# EAGLE design matrix (EAGLE 5.11)
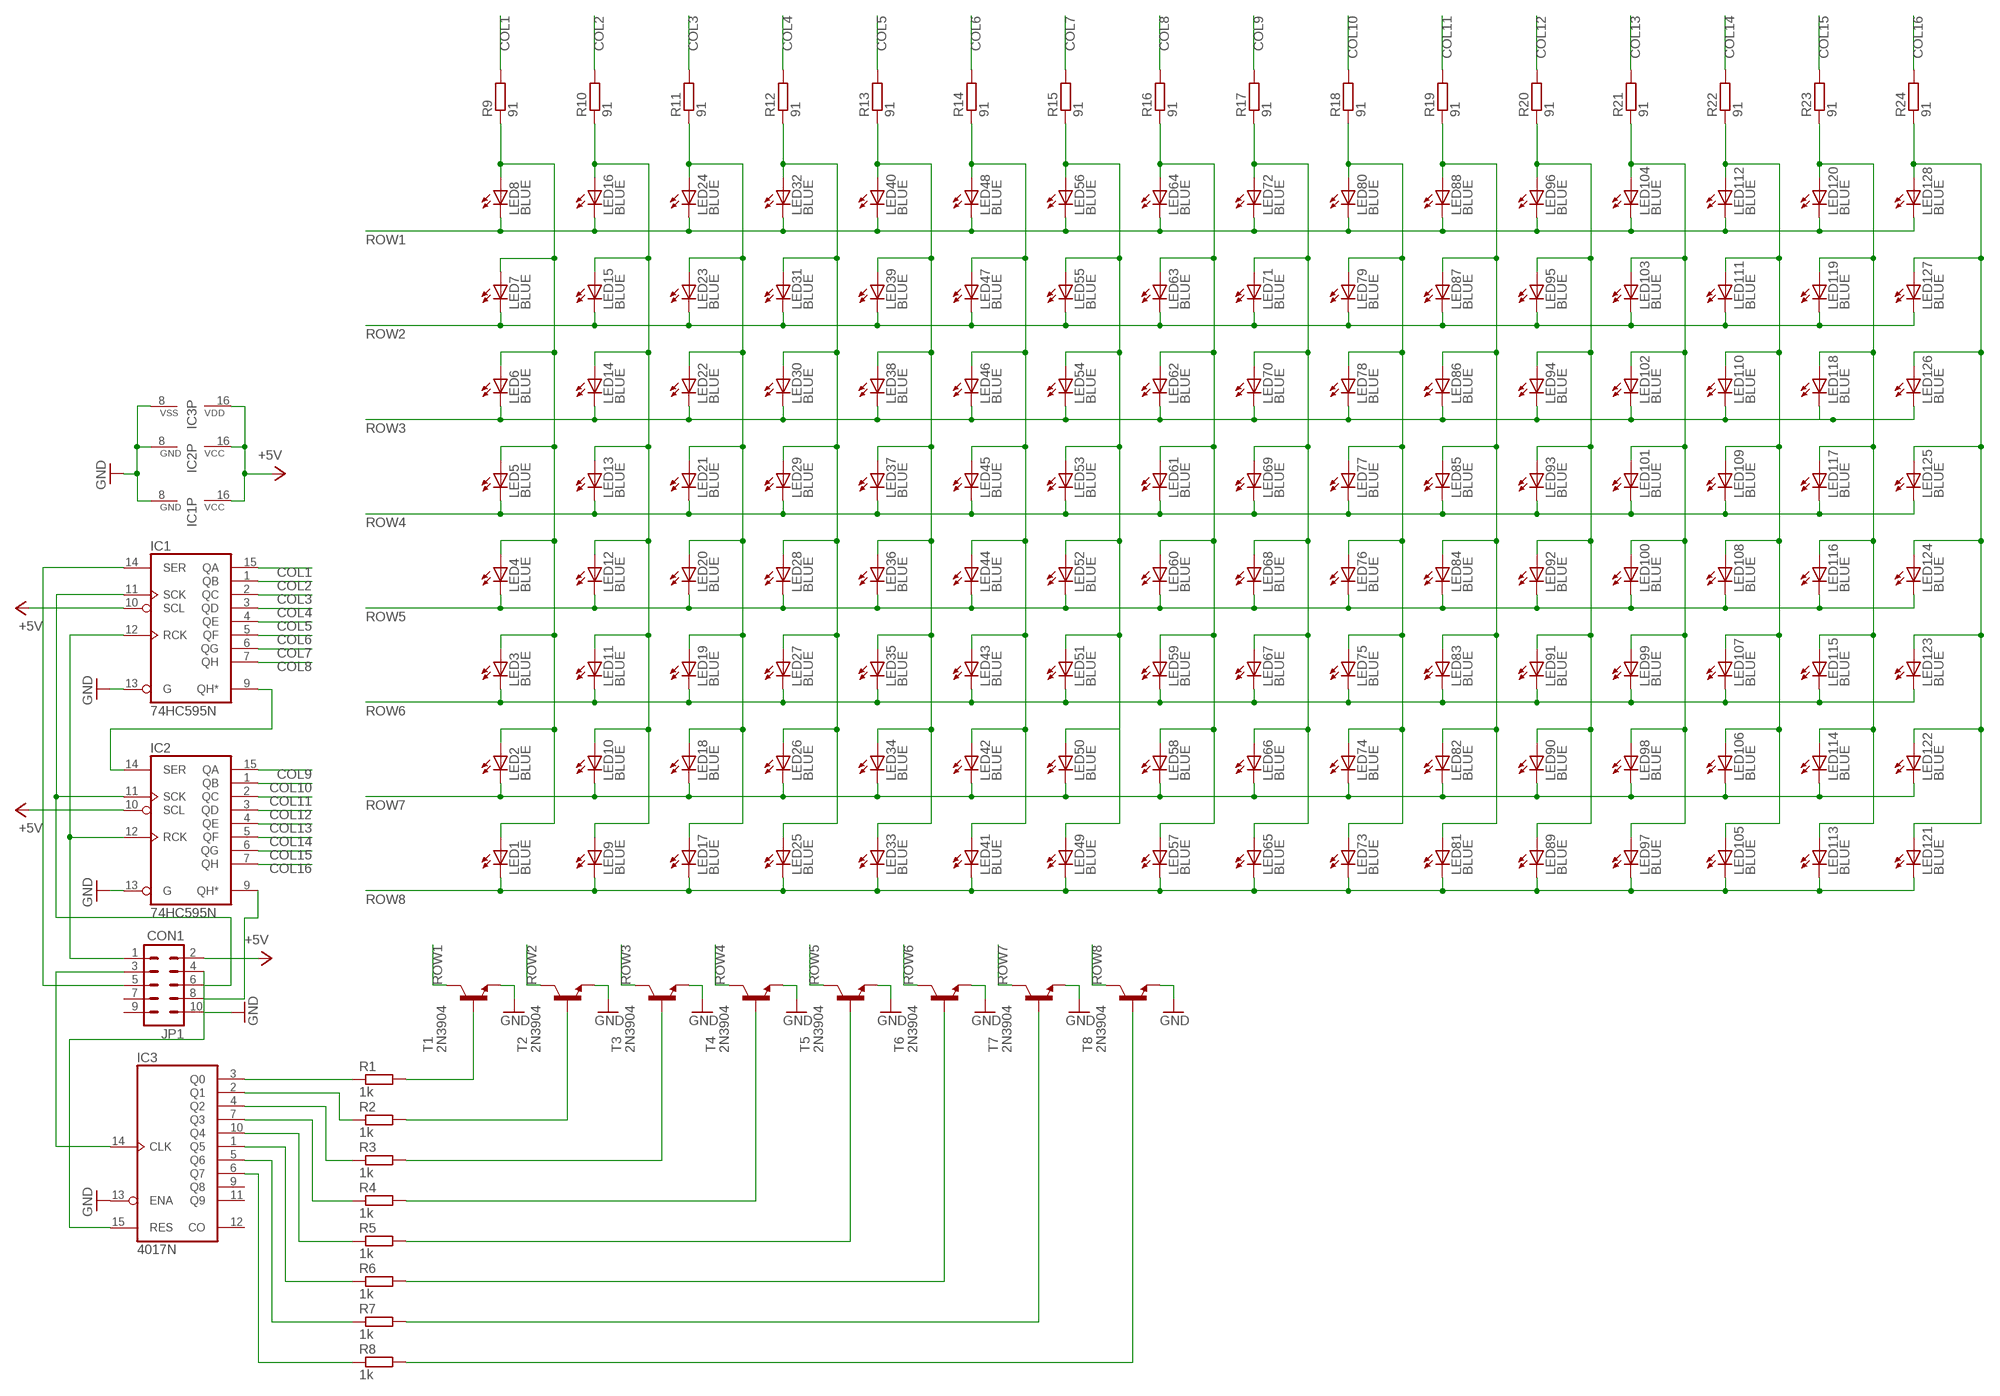
[diagram p0: schematic, sheet 1]

## Parts
IC1  74HC595N  [DIL16]
IC2  74HC595N  [DIL16]
IC3  4017N  [DIL16]
JP1  CON1  ML10  [ML10]
LED1  BLUE  LED5MM  [LED5MM]
LED2  BLUE  LED5MM  [LED5MM]
LED3  BLUE  LED5MM  [LED5MM]
LED4  BLUE  LED5MM  [LED5MM]
LED5  BLUE  LED5MM  [LED5MM]
LED6  BLUE  LED5MM  [LED5MM]
LED7  BLUE  LED5MM  [LED5MM]
LED8  BLUE  LED5MM  [LED5MM]
LED9  BLUE  LED5MM  [LED5MM]
LED10  BLUE  LED5MM  [LED5MM]
LED11  BLUE  LED5MM  [LED5MM]
LED12  BLUE  LED5MM  [LED5MM]
LED13  BLUE  LED5MM  [LED5MM]
LED14  BLUE  LED5MM  [LED5MM]
LED15  BLUE  LED5MM  [LED5MM]
LED16  BLUE  LED5MM  [LED5MM]
LED17  BLUE  LED5MM  [LED5MM]
LED18  BLUE  LED5MM  [LED5MM]
LED19  BLUE  LED5MM  [LED5MM]
LED20  BLUE  LED5MM  [LED5MM]
LED21  BLUE  LED5MM  [LED5MM]
LED22  BLUE  LED5MM  [LED5MM]
LED23  BLUE  LED5MM  [LED5MM]
LED24  BLUE  LED5MM  [LED5MM]
LED25  BLUE  LED5MM  [LED5MM]
LED26  BLUE  LED5MM  [LED5MM]
LED27  BLUE  LED5MM  [LED5MM]
LED28  BLUE  LED5MM  [LED5MM]
LED29  BLUE  LED5MM  [LED5MM]
LED30  BLUE  LED5MM  [LED5MM]
LED31  BLUE  LED5MM  [LED5MM]
LED32  BLUE  LED5MM  [LED5MM]
LED33  BLUE  LED5MM  [LED5MM]
LED34  BLUE  LED5MM  [LED5MM]
LED35  BLUE  LED5MM  [LED5MM]
LED36  BLUE  LED5MM  [LED5MM]
LED37  BLUE  LED5MM  [LED5MM]
LED38  BLUE  LED5MM  [LED5MM]
LED39  BLUE  LED5MM  [LED5MM]
LED40  BLUE  LED5MM  [LED5MM]
LED41  BLUE  LED5MM  [LED5MM]
LED42  BLUE  LED5MM  [LED5MM]
LED43  BLUE  LED5MM  [LED5MM]
LED44  BLUE  LED5MM  [LED5MM]
LED45  BLUE  LED5MM  [LED5MM]
LED46  BLUE  LED5MM  [LED5MM]
LED47  BLUE  LED5MM  [LED5MM]
LED48  BLUE  LED5MM  [LED5MM]
LED49  BLUE  LED5MM  [LED5MM]
LED50  BLUE  LED5MM  [LED5MM]
LED51  BLUE  LED5MM  [LED5MM]
LED52  BLUE  LED5MM  [LED5MM]
LED53  BLUE  LED5MM  [LED5MM]
LED54  BLUE  LED5MM  [LED5MM]
LED55  BLUE  LED5MM  [LED5MM]
LED56  BLUE  LED5MM  [LED5MM]
LED57  BLUE  LED5MM  [LED5MM]
LED58  BLUE  LED5MM  [LED5MM]
LED59  BLUE  LED5MM  [LED5MM]
LED60  BLUE  LED5MM  [LED5MM]
LED61  BLUE  LED5MM  [LED5MM]
LED62  BLUE  LED5MM  [LED5MM]
LED63  BLUE  LED5MM  [LED5MM]
LED64  BLUE  LED5MM  [LED5MM]
LED65  BLUE  LED5MM  [LED5MM]
LED66  BLUE  LED5MM  [LED5MM]
LED67  BLUE  LED5MM  [LED5MM]
LED68  BLUE  LED5MM  [LED5MM]
LED69  BLUE  LED5MM  [LED5MM]
LED70  BLUE  LED5MM  [LED5MM]
LED71  BLUE  LED5MM  [LED5MM]
LED72  BLUE  LED5MM  [LED5MM]
LED73  BLUE  LED5MM  [LED5MM]
LED74  BLUE  LED5MM  [LED5MM]
LED75  BLUE  LED5MM  [LED5MM]
LED76  BLUE  LED5MM  [LED5MM]
LED77  BLUE  LED5MM  [LED5MM]
LED78  BLUE  LED5MM  [LED5MM]
LED79  BLUE  LED5MM  [LED5MM]
LED80  BLUE  LED5MM  [LED5MM]
LED81  BLUE  LED5MM  [LED5MM]
LED82  BLUE  LED5MM  [LED5MM]
LED83  BLUE  LED5MM  [LED5MM]
LED84  BLUE  LED5MM  [LED5MM]
LED85  BLUE  LED5MM  [LED5MM]
LED86  BLUE  LED5MM  [LED5MM]
LED87  BLUE  LED5MM  [LED5MM]
LED88  BLUE  LED5MM  [LED5MM]
LED89  BLUE  LED5MM  [LED5MM]
LED90  BLUE  LED5MM  [LED5MM]
LED91  BLUE  LED5MM  [LED5MM]
LED92  BLUE  LED5MM  [LED5MM]
LED93  BLUE  LED5MM  [LED5MM]
LED94  BLUE  LED5MM  [LED5MM]
LED95  BLUE  LED5MM  [LED5MM]
LED96  BLUE  LED5MM  [LED5MM]
LED97  BLUE  LED5MM  [LED5MM]
LED98  BLUE  LED5MM  [LED5MM]
LED99  BLUE  LED5MM  [LED5MM]
LED100  BLUE  LED5MM  [LED5MM]
LED101  BLUE  LED5MM  [LED5MM]
LED102  BLUE  LED5MM  [LED5MM]
LED103  BLUE  LED5MM  [LED5MM]
LED104  BLUE  LED5MM  [LED5MM]
LED105  BLUE  LED5MM  [LED5MM]
LED106  BLUE  LED5MM  [LED5MM]
LED107  BLUE  LED5MM  [LED5MM]
LED108  BLUE  LED5MM  [LED5MM]
LED109  BLUE  LED5MM  [LED5MM]
LED110  BLUE  LED5MM  [LED5MM]
LED111  BLUE  LED5MM  [LED5MM]
LED112  BLUE  LED5MM  [LED5MM]
LED113  BLUE  LED5MM  [LED5MM]
LED114  BLUE  LED5MM  [LED5MM]
LED115  BLUE  LED5MM  [LED5MM]
LED116  BLUE  LED5MM  [LED5MM]
LED117  BLUE  LED5MM  [LED5MM]
LED118  BLUE  LED5MM  [LED5MM]
LED119  BLUE  LED5MM  [LED5MM]
LED120  BLUE  LED5MM  [LED5MM]
LED121  BLUE  LED5MM  [LED5MM]
LED122  BLUE  LED5MM  [LED5MM]
LED123  BLUE  LED5MM  [LED5MM]
LED124  BLUE  LED5MM  [LED5MM]
LED125  BLUE  LED5MM  [LED5MM]
LED126  BLUE  LED5MM  [LED5MM]
LED127  BLUE  LED5MM  [LED5MM]
LED128  BLUE  LED5MM  [LED5MM]
R1  1k  R-EU_0204/7  [0204/7]
R2  1k  R-EU_0204/7  [0204/7]
R3  1k  R-EU_0204/7  [0204/7]
R4  1k  R-EU_0204/7  [0204/7]
R5  1k  R-EU_0204/7  [0204/7]
R6  1k  R-EU_0204/7  [0204/7]
R7  1k  R-EU_0204/7  [0204/7]
R8  1k  R-EU_0204/7  [0204/7]
R9  91  R-EU_0204/7  [0204/7]
R10  91  R-EU_0204/7  [0204/7]
R11  91  R-EU_0204/7  [0204/7]
R12  91  R-EU_0204/7  [0204/7]
R13  91  R-EU_0204/7  [0204/7]
R14  91  R-EU_0204/7  [0204/7]
R15  91  R-EU_0204/7  [0204/7]
R16  91  R-EU_0204/7  [0204/7]
R17  91  R-EU_0204/7  [0204/7]
R18  91  R-EU_0204/7  [0204/7]
R19  91  R-EU_0204/7  [0204/7]
R20  91  R-EU_0204/7  [0204/7]
R21  91  R-EU_0204/7  [0204/7]
R22  91  R-EU_0204/7  [0204/7]
R23  91  R-EU_0204/7  [0204/7]
R24  91  R-EU_0204/7  [0204/7]
T1  2N3904  [TO92]
T2  2N3904  [TO92]
T3  2N3904  [TO92]
T4  2N3904  [TO92]
T5  2N3904  [TO92]
T6  2N3904  [TO92]
T7  2N3904  [TO92]
T8  2N3904  [TO92]

## Nets
+5V: IC1.10(SCL) IC1.16(VCC) IC2.10(SCL) IC2.16(VCC) IC3.16(VDD) JP1.2
COL1: IC1.15(QA) R9.2
COL2: IC1.1(QB) R10.2
COL3: IC1.2(QC) R11.2
COL4: IC1.3(QD) R12.2
COL5: IC1.4(QE) R13.2
COL6: IC1.5(QF) R14.2
COL7: IC1.6(QG) R15.2
COL8: IC1.7(QH) R16.2
COL9: IC2.15(QA) R17.2
COL10: IC2.1(QB) R18.2
COL11: IC2.2(QC) R19.2
COL12: IC2.3(QD) R20.2
COL13: IC2.4(QE) R21.2
COL14: IC2.5(QF) R22.2
COL15: IC2.6(QG) R23.2
COL16: IC2.7(QH) R24.2
GND: IC1.8(GND) IC1.13(G) IC2.8(GND) IC2.13(G) IC3.8(VSS) IC3.13(ENA) JP1.10 T1.3(E) T2.3(E) T3.3(E) T4.3(E) T5.3(E) T6.3(E) T7.3(E) T8.3(E)
N$1: IC1.9(QH*) IC2.14(SER)
N$2: IC2.9(QH*) JP1.8
N$3: IC1.12(RCK) IC2.12(RCK) JP1.1
N$4: LED121.A LED122.A LED123.A LED124.A LED125.A LED126.A LED127.A LED128.A R24.1
N$5: IC1.11(SCK) IC2.11(SCK) JP1.6
N$6: IC1.14(SER) JP1.5
N$7: IC3.14(CLK) JP1.3
N$8: IC3.15(RES) JP1.4
N$9: IC3.3(Q0) R1.1
N$10: IC3.2(Q1) R2.1
N$11: IC3.4(Q2) R3.1
N$12: IC3.7(Q3) R4.1
N$13: IC3.10(Q4) R5.1
N$14: IC3.1(Q5) R6.1
N$15: IC3.5(Q6) R7.1
N$16: IC3.6(Q7) R8.1
N$17: R1.2 T1.2(B)
N$18: R2.2 T2.2(B)
N$19: R3.2 T3.2(B)
N$20: R4.2 T4.2(B)
N$21: R5.2 T5.2(B)
N$22: R6.2 T6.2(B)
N$23: R7.2 T7.2(B)
N$24: R8.2 T8.2(B)
N$25: LED1.A LED2.A LED3.A LED4.A LED5.A LED6.A LED7.A LED8.A R9.1
N$26: LED9.A LED10.A LED11.A LED12.A LED13.A LED14.A LED15.A LED16.A R10.1
N$29: LED33.A LED34.A LED35.A LED36.A LED37.A LED38.A LED39.A LED40.A R13.1
N$30: LED41.A LED42.A LED43.A LED44.A LED45.A LED46.A LED47.A LED48.A R14.1
N$31: LED49.A LED50.A LED51.A LED52.A LED53.A LED54.A LED55.A LED56.A R15.1
N$32: LED57.A LED58.A LED59.A LED60.A LED61.A LED62.A LED63.A LED64.A R16.1
N$33: LED65.A LED66.A LED67.A LED68.A LED69.A LED70.A LED71.A LED72.A R17.1
N$34: LED73.A LED74.A LED75.A LED76.A LED77.A LED78.A LED79.A LED80.A R18.1
N$35: LED81.A LED82.A LED83.A LED84.A LED85.A LED86.A LED87.A LED88.A R19.1
N$36: LED89.A LED90.A LED91.A LED92.A LED93.A LED94.A LED95.A LED96.A R20.1
N$37: LED97.A LED98.A LED99.A LED100.A LED101.A LED102.A LED103.A LED104.A R21.1
N$38: LED105.A LED106.A LED107.A LED108.A LED109.A LED110.A LED111.A LED112.A R22.1
N$39: LED113.A LED114.A LED115.A LED116.A LED117.A LED118.A LED119.A LED120.A R23.1
N$49: LED17.A LED18.A LED19.A LED20.A LED21.A LED22.A LED23.A LED24.A R11.1
N$50: LED25.A LED26.A LED27.A LED28.A LED29.A LED30.A LED31.A LED32.A R12.1
ROW1: LED8.K(C) LED16.K(C) LED24.K(C) LED32.K(C) LED40.K(C) LED48.K(C) LED56.K(C) LED64.K(C) LED72.K(C) LED80.K(C) LED88.K(C) LED96.K(C) LED104.K(C) LED112.K(C) LED120.K(C) LED128.K(C) T1.1(C)
ROW2: LED7.K(C) LED15.K(C) LED23.K(C) LED31.K(C) LED39.K(C) LED47.K(C) LED55.K(C) LED63.K(C) LED71.K(C) LED79.K(C) LED87.K(C) LED95.K(C) LED103.K(C) LED111.K(C) LED119.K(C) LED127.K(C) T2.1(C)
ROW3: LED6.K(C) LED14.K(C) LED22.K(C) LED30.K(C) LED38.K(C) LED46.K(C) LED54.K(C) LED62.K(C) LED70.K(C) LED78.K(C) LED86.K(C) LED94.K(C) LED102.K(C) LED110.K(C) LED118.K(C) LED126.K(C) T3.1(C)
ROW4: LED5.K(C) LED13.K(C) LED21.K(C) LED29.K(C) LED37.K(C) LED45.K(C) LED53.K(C) LED61.K(C) LED69.K(C) LED77.K(C) LED85.K(C) LED93.K(C) LED101.K(C) LED109.K(C) LED117.K(C) LED125.K(C) T4.1(C)
ROW5: LED4.K(C) LED12.K(C) LED20.K(C) LED28.K(C) LED36.K(C) LED44.K(C) LED52.K(C) LED60.K(C) LED68.K(C) LED76.K(C) LED84.K(C) LED92.K(C) LED100.K(C) LED108.K(C) LED116.K(C) LED124.K(C) T5.1(C)
ROW6: LED3.K(C) LED11.K(C) LED19.K(C) LED27.K(C) LED35.K(C) LED43.K(C) LED51.K(C) LED59.K(C) LED67.K(C) LED75.K(C) LED83.K(C) LED91.K(C) LED99.K(C) LED107.K(C) LED115.K(C) LED123.K(C) T6.1(C)
ROW7: LED2.K(C) LED10.K(C) LED18.K(C) LED26.K(C) LED34.K(C) LED42.K(C) LED50.K(C) LED58.K(C) LED66.K(C) LED74.K(C) LED82.K(C) LED90.K(C) LED98.K(C) LED106.K(C) LED114.K(C) LED122.K(C) T7.1(C)
ROW8: LED1.K(C) LED9.K(C) LED17.K(C) LED25.K(C) LED33.K(C) LED41.K(C) LED49.K(C) LED57.K(C) LED65.K(C) LED73.K(C) LED81.K(C) LED89.K(C) LED97.K(C) LED105.K(C) LED113.K(C) LED121.K(C) T8.1(C)
Unconnected: IC3.9(Q8) IC3.11(Q9) IC3.12(CO) JP1.7 JP1.9

## Library data of the parts
IC1 IC2 = 74xx-eu:74*595: 8-bit SHIFT REGISTER, output latch
IC3 = 40xx:4017: COUNTER/DIVIDER
JP1 = con-harting-ml:ML10: HARTING; OC_FARNELL: unknown; OC_NEWARK: unknown
LED1-LED128 = led:LED: LED OSRAM: - CHIPLED LG R971, LG N971, LY N971, LG Q971, LY Q971, LO R971, LY R971 LH N974, LH R974 LS Q976, LO Q976, LY Q976 LO Q996 - Hyper CHIPLED LW Q18S LB Q993, LB Q99A, LB R99A - SideLED LS A670, LO A670, LY A670, LG A670, LP A670 LB A673, LV A673, LT A673, LW A673 LH A674 LY A675 LS A676, LA A676, LO A676, LY A676, LW A676 LS A679, LY A679, LG A679 - Hyper Micro SIDELED® LS Y876, LA Y876, LO Y876, LY Y876 LT Y87S - SmartLED LW L88C, LW L88S LB L89C, LB L89S, LG L890 LS L89K, LO L89K, LY L89K LS L896, LA L896, LO L896, LY L896 - TOPLED LS T670, LO T670, LY T670, LG T670, LP T670 LSG T670, LSP T670, LSY T670, LOP T670, LYG T670 LG T671, LOG T671, LSG T671 LB T673, LV T673, LT T673, LW T673 LH T674 LS T676, LA T676, LO T676, LY T676, LB T676, LH T676, LSB T676, LW T676 LB T67C, LV T67C, LT T67C, LS T67K, LO T67K, LY T67K, LW E67C LS E67B, LA E67B, LO E67B, LY E67B, LB E67C, LV E67C, LT E67C LW T67C LS T679, LY T679, LG T679 LS T770, LO T770, LY T770, LG T770, LP T770 LB T773, LV T773, LT T773, LW T773 LH T774 LS E675, LA E675, LY E675, LS T675 LS T776, LA T776, LO T776, LY T776, LB T776 LHGB T686 LT T68C, LB T68C - Hyper Mini TOPLED® LB M676 - Mini TOPLED Santana® LG M470 LS M47K, LO M47K, LY M47K Source: http://www.osram.convergy.de LUXEON: - LUMILED® LXK2-PW12-R00, LXK2-PW12-S00, LXK2-PW14-U00, LXK2-PW14-V00 LXK2-PM12-R00, LXK2-PM12-S00, LXK2-PM14-U00 LXK2-PE12-Q00, LXK2-PE12-R00, LXK2-PE12-S00, LXK2-PE14-T00, LXK2-PE14-U00 LXK2-PB12-K00, LXK2-PB12-L00, LXK2-PB12-M00, LXK2-PB14-N00, LXK2-PB14-P00, LXK2-PB14-Q00 LXK2-PR12-L00, LXK2-PR12-M00, LXK2-PR14-Q00, LXK2-PR14-R00 LXK2-PD12-Q00, LXK2-PD12-R00, LXK2-PD12-S00 LXK2-PH12-R00, LXK2-PH12-S00 LXK2-PL12-P00, LXK2-PL12-Q00, LXK2-PL12-R00 Source: www.luxeon.com KINGBRIGHT: KA-3528ASYC Source: www.kingbright.com
R1-R24 = rcl:R-EU_: RESISTOR, European symbol
T1-T8 = transistor:2N3904: NPN TRANSISTOR

## Board
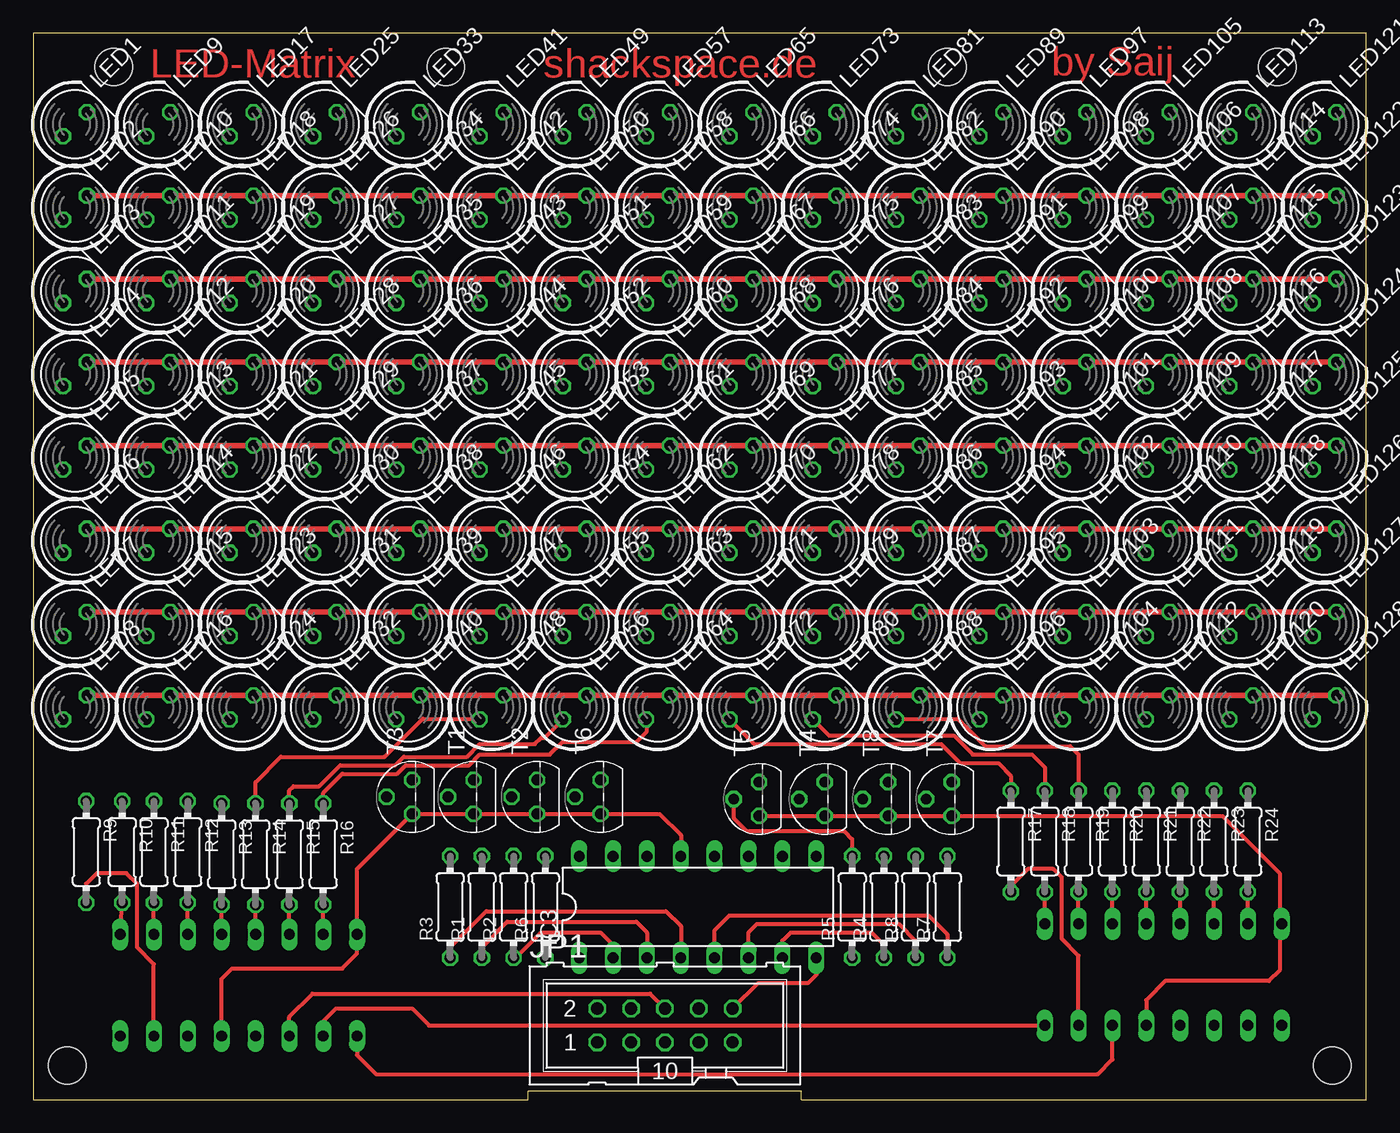
[diagram p1: board, top side]
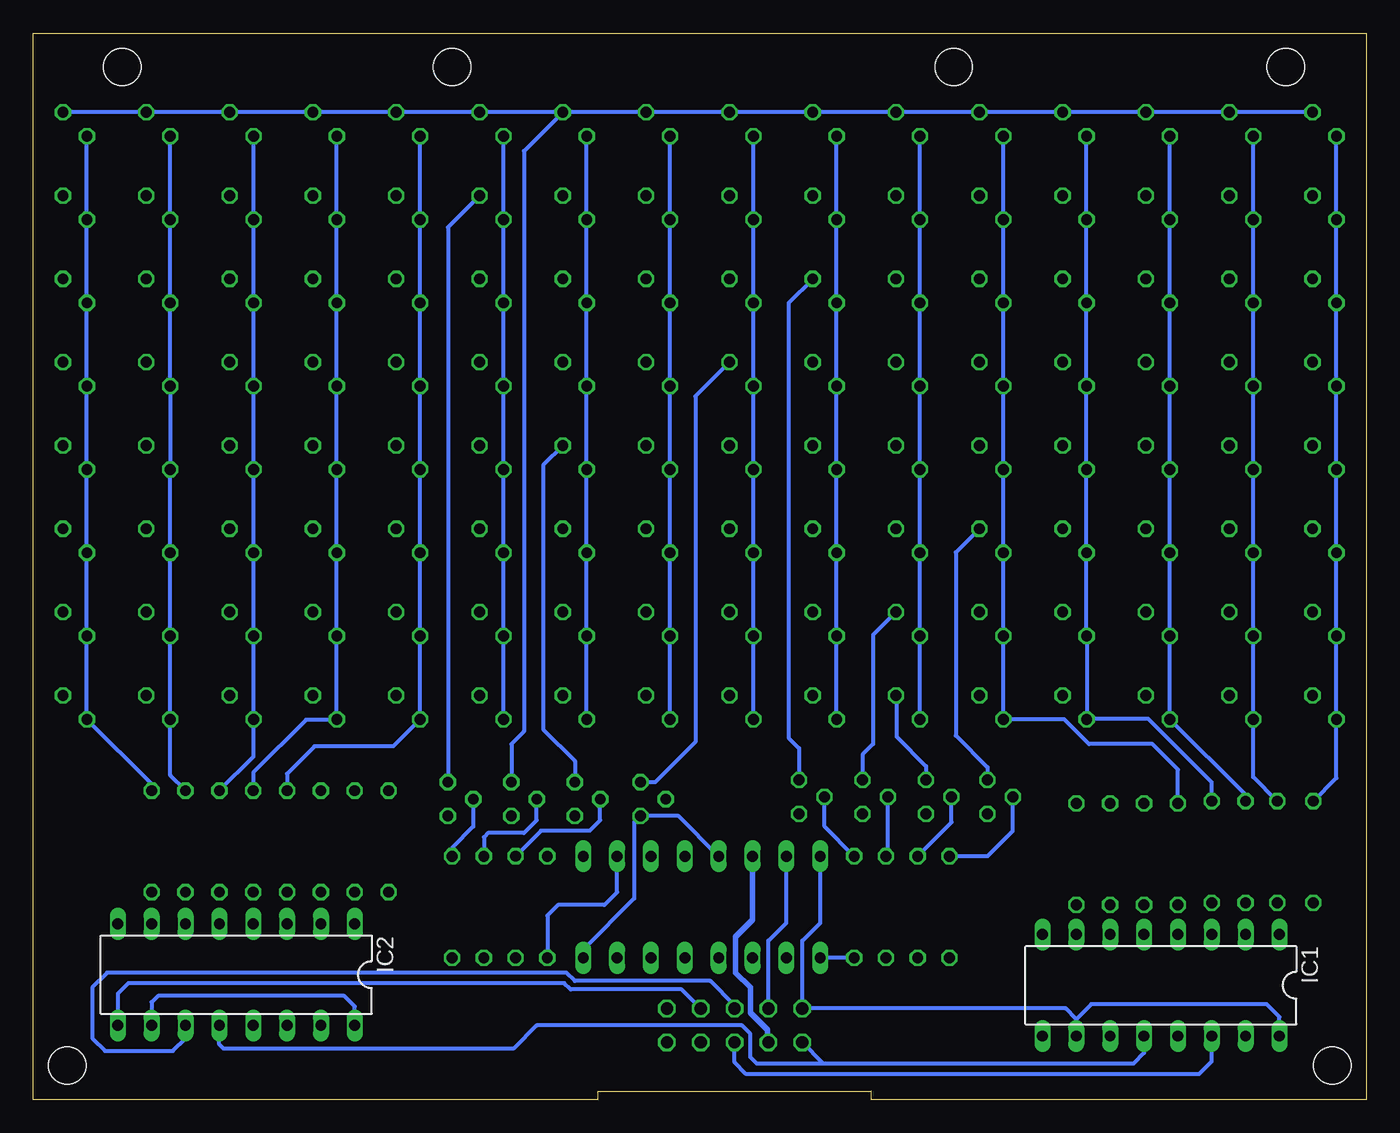
[diagram p2: board, bottom side, seen from below]

Size 100 x 80 mm. Coordinates in mm from the lower left corner, seen from the top.
Outline: 37.13,0.64 37.13,0 0,0 0,80 100,80 100,0 57.63,0 57.63,0.64 37.13,0.64
Outline: 37.13,0.64 37.15,0.64
Copper layers (1*16): Top 0.035mm / dielectric 1.5mm / Bottom 0.035mm
Design rules "PCB-POOL Standard": minimum track width 0.15mm, minimum drill 0.3mm, track to track 0.15mm, track to pad 0.15mm, pad to pad 0.15mm, via to via 0.15mm, smd to smd 0.15mm, copper to edge 0.3mm, drill to drill 0.2mm, minimum pad ring 0.2mm, minimum via ring 0.15mm, stop-mask expansion 0.075mm, vias tented up to drill 0mil, thermal gap 0.2mm
Holes 2.8 mm at 6.03,77.47 93.33,77.47 68.58,77.47 30.96,77.47 2.54,2.54 97.46,2.54

### Footprints (pad centres in the part's own frame; a part is rotated, then mirrored left to right if it is on the bottom)
DIL16 = drill 0.813 long: 1 -8.89,-3.81; 2 -6.35,-3.81; 3 -3.81,-3.81; 4 -1.27,-3.81; 5 1.27,-3.81; 6 3.81,-3.81; 7 6.35,-3.81; 8 8.89,-3.81; 9 8.89,3.81; 10 6.35,3.81; 11 3.81,3.81; 12 1.27,3.81; 13 -1.27,3.81; 14 -3.81,3.81; 15 -6.35,3.81; 16 -8.89,3.81
ML10 = drill 0.914 octagon: 1 -5.08,-1.27; 2 -5.08,1.27; 3 -2.54,-1.27; 4 -2.54,1.27; 5 0,-1.27; 6 0,1.27; 7 2.54,-1.27; 8 2.54,1.27; 9 5.08,-1.27; 10 5.08,1.27
LED5MM = drill 0.813 octagon: A -1.27,0; K 1.27,0
0204/7 = drill 0.813 octagon: 1 -3.81,0; 2 3.81,0
TO92 = drill 0.813 octagon: 1 1.27,0; 2 0,1.905; 3 -1.27,0

### Placement (x,y rotation side)
IC1  15.4,8.57 180 bottom
IC2  84.77,9.37 180 bottom
IC3  49.85,14.45 0 top
JP1  47.39,5.56 0 top
LED1  3.12,73.17 45 top
LED2  3.12,66.92 45 top
LED3  3.12,60.67 45 top
LED4  3.12,54.42 45 top
LED5  3.12,48.17 45 top
LED6  3.12,41.92 45 top
LED7  3.12,35.67 45 top
LED8  3.12,29.43 45 top
LED9  9.38,73.17 45 top
LED10  9.38,66.92 45 top
LED11  9.38,60.67 45 top
LED12  9.38,54.42 45 top
LED13  9.38,48.17 45 top
LED14  9.38,41.92 45 top
LED15  9.38,35.67 45 top
LED16  9.38,29.43 45 top
LED17  15.62,73.17 45 top
LED18  15.62,66.92 45 top
LED19  15.62,60.67 45 top
LED20  15.62,54.42 45 top
LED21  15.62,48.17 45 top
LED22  15.62,41.92 45 top
LED23  15.62,35.67 45 top
LED24  15.62,29.43 45 top
LED25  21.88,73.17 45 top
LED26  21.88,66.92 45 top
LED27  21.88,60.67 45 top
LED28  21.88,54.42 45 top
LED29  21.88,48.17 45 top
LED30  21.88,41.92 45 top
LED31  21.88,35.67 45 top
LED32  21.88,29.43 45 top
LED33  28.12,73.17 45 top
LED34  28.12,66.92 45 top
LED35  28.12,60.67 45 top
LED36  28.12,54.42 45 top
LED37  28.12,48.17 45 top
LED38  28.12,41.92 45 top
LED39  28.12,35.67 45 top
LED40  28.12,29.43 45 top
LED41  34.38,73.17 45 top
LED42  34.38,66.92 45 top
LED43  34.38,60.67 45 top
LED44  34.38,54.42 45 top
LED45  34.38,48.17 45 top
LED46  34.38,41.92 45 top
LED47  34.38,35.67 45 top
LED48  34.38,29.43 45 top
LED49  40.62,73.17 45 top
LED50  40.62,66.92 45 top
LED51  40.62,60.67 45 top
LED52  40.62,54.42 45 top
LED53  40.62,48.17 45 top
LED54  40.62,41.92 45 top
LED55  40.62,35.67 45 top
LED56  40.62,29.43 45 top
LED57  46.88,73.17 45 top
LED58  46.88,66.92 45 top
LED59  46.88,60.67 45 top
LED60  46.88,54.42 45 top
LED61  46.88,48.17 45 top
LED62  46.88,41.92 45 top
LED63  46.88,35.67 45 top
LED64  46.88,29.43 45 top
LED65  53.12,73.17 45 top
LED66  53.12,66.92 45 top
LED67  53.12,60.67 45 top
LED68  53.12,54.42 45 top
LED69  53.12,48.17 45 top
LED70  53.12,41.92 45 top
LED71  53.12,35.67 45 top
LED72  53.12,29.43 45 top
LED73  59.38,73.17 45 top
LED74  59.38,66.92 45 top
LED75  59.38,60.67 45 top
LED76  59.38,54.42 45 top
LED77  59.38,48.17 45 top
LED78  59.38,41.92 45 top
LED79  59.38,35.67 45 top
LED80  59.38,29.43 45 top
LED81  65.62,73.17 45 top
LED82  65.62,66.92 45 top
LED83  65.62,60.67 45 top
LED84  65.62,54.42 45 top
LED85  65.62,48.17 45 top
LED86  65.62,41.92 45 top
LED87  65.62,35.67 45 top
LED88  65.62,29.43 45 top
LED89  71.88,73.17 45 top
LED90  71.88,66.92 45 top
LED91  71.88,60.67 45 top
LED92  71.88,54.42 45 top
LED93  71.88,48.17 45 top
LED94  71.88,41.92 45 top
LED95  71.88,35.67 45 top
LED96  71.88,29.43 45 top
LED97  78.12,73.17 45 top
LED98  78.12,66.92 45 top
LED99  78.12,60.67 45 top
LED100  78.12,54.42 45 top
LED101  78.12,48.17 45 top
LED102  78.12,41.92 45 top
LED103  78.12,35.67 45 top
LED104  78.12,29.43 45 top
LED105  84.38,73.17 45 top
LED106  84.38,66.92 45 top
LED107  84.38,60.67 45 top
LED108  84.38,54.42 45 top
LED109  84.38,48.17 45 top
LED110  84.38,41.92 45 top
LED111  84.38,35.67 45 top
LED112  84.38,29.43 45 top
LED113  90.62,73.17 45 top
LED114  90.62,66.92 45 top
LED115  90.62,60.67 45 top
LED116  90.62,54.42 45 top
LED117  90.62,48.17 45 top
LED118  90.62,41.92 45 top
LED119  90.62,35.67 45 top
LED120  90.62,29.43 45 top
LED121  96.88,73.17 45 top
LED122  96.88,66.92 45 top
LED123  96.88,60.67 45 top
LED124  96.88,54.42 45 top
LED125  96.88,48.17 45 top
LED126  96.88,41.92 45 top
LED127  96.88,35.67 45 top
LED128  96.88,29.43 45 top
R1  33.66,14.45 90 top
R2  36.04,14.45 90 top
R3  31.27,14.45 90 top
R4  63.82,14.45 90 top
R5  61.44,14.45 90 top
R6  38.42,14.45 90 top
R7  68.58,14.45 90 top
R8  66.2,14.45 90 top
R9  3.97,18.57 270 top
R10  6.67,18.57 270 top
R11  9.05,18.57 270 top
R12  11.59,18.57 270 top
R13  14.13,18.42 270 top
R14  16.67,18.41 270 top
R15  19.21,18.42 270 top
R16  21.75,18.41 270 top
R17  73.34,19.37 270 top
R18  75.88,19.37 270 top
R19  78.42,19.37 270 top
R20  80.96,19.37 270 top
R21  83.5,19.37 270 top
R22  86.04,19.37 270 top
R23  88.58,19.37 270 top
R24  91.12,19.37 270 top
T1  33.02,22.7 90 top
T2  37.78,22.7 90 top
T3  28.42,22.7 90 top
T4  59.37,22.54 90 top
T5  54.45,22.54 90 top
T6  42.55,22.7 90 top
T7  68.9,22.54 90 top
T8  64.14,22.54 90 top

### Tracks (layer width: path | path; a pad name or v marks a point on that pad's centre or on a via)
+5V
  Top 0.305: IC2.16 29.69,5.56 28.42,6.83 22.7,6.83 21.75,5.87 IC1.10
  Bottom 0.305: IC3.16 40.96,13.26 42.31,11.91 JP1.2 | JP1.2 | JP1.2 22.54,6.83 21.75,6.03 | 21.75,6.03 IC1.10 | 21.75,6.03 20.64,7.14 7.46,7.14 6.51,6.19 IC1.16 | IC2.10 91.12,7.3 90.65,7.78 76.68,7.78 75.88,6.99 IC2.16
COL1
  Top 0.305: R9.2 3.97,16.19 4.76,16.99 6.99,16.99 7.78,16.19 7.78,11.43 9.05,10.16 IC1.15
COL2
  Top 0.305: IC1.1 R10.2
COL3
  Top 0.305: IC1.2 R11.2 | R11.2
COL4
  Top 0.305: IC1.3 R12.2 | R12.2
COL5
  Top 0.305: IC1.4 R13.2
COL6
  Top 0.305: IC1.5 R14.2
COL7
  Top 0.305: IC1.6 R15.2 | R15.2
COL8
  Top 0.305: IC1.7 R16.2
COL9
  Top 0.305: R17.2 73.34,16.03 74.61,17.3 76.52,17.3 77.15,16.67 77.15,12.06 78.42,10.79 IC2.15
COL10
  Top 0.305: IC2.1 R18.2
COL11
  Top 0.305: IC2.2 R19.2
COL12
  Top 0.305: IC2.3 R20.2
COL13
  Top 0.305: IC2.4 R21.2
COL14
  Top 0.305: IC2.5 86.04,12.86 R22.2
COL15
  Top 0.305: IC2.6 R23.2
COL16
  Top 0.305: IC2.7 R24.2
GND
  Top 0.305: IC1.13 14.13,9.05 14.92,9.84 23.18,9.84 24.29,10.95 IC1.8 24.29,17.3 T3.3 | T5.3 T4.3 T8.3 T7.3 89.22,21.27 93.5,16.99 93.5,13.34 | T1.3 T2.3 T6.3 46.99,21.43 48.58,19.84 IC3.13 | T1.3 | T3.3 T1.3 | T3.3 | IC3.8 58.74,9.37 58.1,8.73 54.37,8.73 JP1.10 | 93.5,13.34 IC2.8 | 93.5,13.34 93.5,9.68 92.71,8.89 84.93,8.89 83.5,7.46 IC2.13
  Bottom 0.305: IC3.8 58.74,11.27 54.93,15.08 54.93,20.8 T5.3 51.59,21.27 IC3.13
N$1
  Top 0.305: IC1.9 24.29,3.33 25.72,1.91 79.85,1.91 80.96,3.02 IC2.14
N$2
  Bottom 0.305: IC2.9 93.66,7.94 93.34,8.26 | 93.34,8.26 | 93.34,8.26 92.87,8.73 60.17,8.73 59.69,8.26 51.36,8.26 JP1.8
N$3
  Bottom 0.305: IC1.12 16.67,3.49 17.46,2.7 40.72,2.7 | 40.72,2.7 JP1.1 | IC2.12 86.04,4.13 85.72,3.81 63.98,3.81 62.23,5.56 46.83,5.56 46.2,4.92 46.2,3.17 45.72,2.7 40.72,2.7
N$4
  Bottom 0.305: R24.1 91.12,23.67 LED128.A LED127.A LED126.A LED125.A LED124.A LED123.A LED122.A LED121.A
N$5
  Top 0.305: IC1.11 19.21,6.19 20.95,7.94 46.28,7.94 JP1.6
  Bottom 0.305: JP1.6 47.39,7.06 49.21,8.89 59.37,8.89 60.01,9.53 94.46,9.53 95.57,8.41 95.57,4.6 94.61,3.65 89.53,3.65 88.58,4.6 IC2.11
N$6
  Bottom 0.305: JP1.5 47.39,2.78 46.51,1.91 12.54,1.91 11.59,2.86 IC1.14
N$7
  Bottom 0.406: IC3.14 46.04,13.49 47.31,12.22 47.31,9.53 46.2,8.41 46.2,6.51 44.93,5.24 44.93,4.37 JP1.3
N$8
  Bottom 0.305: IC3.15 43.5,13.26 44.85,11.91 44.85,6.35 JP1.4
N$9
  Top 0.305: R1.1 33.66,11.43 35.56,13.34 45.24,13.34 46.04,12.54 IC3.3
N$10
  Top 0.305: R2.1 36.2,10.64 38.1,12.54 42.55,12.54 43.5,11.59 IC3.2
N$11
  Top 0.305: R3.1 31.27,11.43 33.97,14.13 47.47,14.13 48.58,13.02 IC3.4
N$12
  Top 0.305: R4.1 63.82,11.59 62.87,12.54 56.83,12.54 56.2,11.91 IC3.7
N$13
  Bottom 0.305: R5.1 61.44,13.81 60.64,14.61 57.15,14.61 56.2,15.56 IC3.10
N$14
  Bottom 0.305: R6.1 IC3.1
N$15
  Top 0.305: R7.1 68.58,12.38 67.15,13.81 52.23,13.81 51.12,12.7 IC3.5
N$16
  Top 0.305: R8.1 66.2,11.91 64.93,13.18 54.29,13.18 53.66,12.54 IC3.6
N$17
  Bottom 0.305: T1.2 31.11,20.8 R1.2
N$18
  Bottom 0.305: T2.2 35.88,18.41 R2.2
N$19
  Bottom 0.305: T3.2 26.51,20.16 28.42,18.26 R3.2
N$20
  Bottom 0.305: R4.2 61.91,20.16 58.26,20.16 57.47,20.95 T4.2
N$21
  Top 0.305: R5.2 61.44,19.53 60.8,20.16 53.5,20.16 52.55,21.11 T5.2
N$22
  Bottom 0.305: T6.2 40.64,20.48 R6.2
N$23
  Bottom 0.305: R7.2 68.58,18.89 66.99,20.48 T7.2
N$24
  Bottom 0.305: R8.2 66.2,19.68 65.88,20 63.18,20 62.23,20.95 T8.2
N$25
  Bottom 0.305: R9.1 2.23,24.12 LED8.A LED7.A LED6.A LED5.A LED4.A LED3.A LED2.A LED1.A
N$26
  Bottom 0.305: R10.1 8.48,24.19 LED16.A LED15.A LED14.A LED13.A LED12.A LED11.A LED10.A LED9.A
N$29
  Bottom 0.305: R13.1 14.13,24.77 16.03,26.67 20.8,26.67 22.65,28.53 LED40.A LED39.A LED38.A LED37.A LED36.A LED35.A LED34.A LED33.A
N$30
  Top 0.305: R14.1 16.67,23.81 18.57,25.72 26.35,25.72 29.21,28.57 33.43,28.57 LED48.A
  Bottom 0.305: LED48.A LED47.A LED46.A LED45.A LED44.A LED43.A LED42.A LED41.A
N$31
  Top 0.305: R15.1 19.21,23.18 19.53,23.5 21.43,23.5 23.02,25.08 27.15,25.08 27.78,25.72 32.54,25.72 33.5,26.67 37.62,26.67 38.1,27.15 38.35,27.15 LED56.A
  Bottom 0.305: LED49.A LED50.A LED51.A LED52.A LED53.A LED54.A LED55.A LED56.A
N$32
  Top 0.305: R16.1 21.75,23.02 23.18,24.45 27.3,24.45 27.94,25.08 32.7,25.08 33.5,25.88 38.73,25.88 39.69,26.83 45.24,26.83 46.04,27.62 46.04,28.47 LED64.A
  Bottom 0.305: LED57.A LED58.A LED59.A LED60.A LED61.A LED62.A LED63.A LED64.A 46.04,28.47
N$33
  Top 0.305: R17.1 73.34,24.29 72.39,25.24 69.53,25.24 68.1,26.67 54.08,26.67 LED72.A
  Bottom 0.305: LED65.A LED66.A LED67.A LED68.A LED69.A LED70.A LED71.A LED72.A
N$34
  Top 0.305: R18.1 75.88,24.92 74.93,25.88 70.48,25.88 69.06,27.3 59.7,27.3 LED80.A
  Bottom 0.305: 58.42,28.47 LED80.A LED79.A LED78.A LED77.A LED76.A LED75.A LED74.A LED73.A
N$35
  Top 0.305: R19.1 78.42,25.88 77.79,26.51 71.44,26.51 69.37,28.57 64.78,28.57 LED88.A
  Bottom 0.305: LED81.A LED82.A LED83.A LED84.A LED85.A LED86.A LED87.A LED88.A
N$36
  Bottom 0.305: R20.1 80.96,24.45 78.9,26.51 72.99,26.51 LED96.A LED95.A LED94.A LED93.A LED92.A LED91.A LED90.A LED89.A
N$37
  Bottom 0.305: R21.1 83.5,24.53 79.53,28.5 77.26,28.5 LED104.A LED103.A LED102.A LED101.A LED100.A LED99.A LED98.A LED97.A
N$38
  Bottom 0.305: R22.1 83.48,25.74 LED112.A LED111.A LED110.A LED109.A LED108.A LED107.A LED106.A LED105.A
N$39
  Bottom 0.305: R23.1 89.73,24.32 LED120.A LED119.A LED118.A LED117.A 89.73,47.78 89.69,47.78 89.69,53.53 LED116.A LED115.A LED114.A LED113.A
N$49
  Bottom 0.305: R11.1 9.05,22.85 LED24.A LED23.A LED22.A LED21.A LED20.A LED19.A LED18.A LED17.A
N$50
  Bottom 0.305: R12.1 11.59,23.81 16.35,28.57 20.93,28.57 | 20.93,28.57 LED32.A | 20.93,28.57 20.93,34.73 LED31.A LED30.A LED29.A LED28.A LED27.A LED26.A LED25.A
ROW1
  Top 0.406: LED128.K LED120.K LED112.K LED104.K LED96.K LED88.K LED80.K LED72.K LED64.K LED56.K LED48.K LED40.K LED32.K LED24.K LED16.K LED8.K
  Bottom 0.305: T1.1 33.02,25 35.24,27.23 35.24,30.29 LED48.K
ROW2
  Top 0.406: LED7.K LED15.K LED23.K LED31.K LED39.K LED47.K LED55.K LED63.K LED71.K LED79.K LED87.K LED95.K LED103.K LED111.K LED119.K LED127.K
  Bottom 0.305: T2.1 37.78,25.88 36.99,26.67 36.99,34.86 LED47.K
ROW3
  Top 0.406: LED126.K LED118.K LED110.K LED102.K LED94.K LED86.K LED78.K LED70.K LED62.K LED54.K LED46.K LED38.K LED30.K LED22.K LED14.K LED6.K
  Bottom 0.305: T3.1 28.42,24.92 30.8,27.3 30.8,41.05 LED38.K
ROW4
  Top 0.406: LED5.K LED13.K LED21.K | LED21.K 16.97,49.07 16.99,49.05 16.54,49.05 LED21.K | LED21.K LED29.K LED37.K LED45.K LED53.K LED61.K LED69.K LED77.K LED85.K LED93.K LED101.K LED109.K LED117.K LED125.K
  Bottom 0.254: LED29.K 22.7,49.05 | LED61.K 47.62,49.05 | LED45.K 35.24,49.05
  Bottom 0.305: T4.1 59.37,25.4 61.75,27.78 61.75,47.59 LED77.K
ROW5
  Top 0.406: LED4.K LED12.K LED20.K LED28.K LED36.K LED44.K LED52.K LED60.K LED68.K LED76.K LED84.K LED92.K LED100.K LED108.K LED116.K LED124.K
  Bottom 0.305: T5.1 53.34,23.81 50.32,26.83 50.32,52.77 LED60.K
ROW6
  Top 0.406: LED3.K LED11.K LED19.K LED27.K LED35.K LED43.K LED51.K LED59.K LED67.K LED75.K LED83.K LED91.K LED99.K LED107.K LED115.K LED123.K
  Bottom 0.254: LED43.K 35.24,61.59
  Bottom 0.305: T6.1 42.55,26.35 43.34,27.15 43.34,59.76 LED51.K
ROW7
  Top 0.406: LED2.K LED10.K LED18.K LED26.K LED34.K LED42.K LED50.K LED58.K LED66.K LED74.K LED82.K LED90.K LED98.K LED106.K LED114.K LED122.K
  Bottom 0.254: LED58.K 47.62,67.79 | LED42.K 35.24,67.79
  Bottom 0.305: T7.1 68.9,65.45 LED82.K
ROW8
  Bottom 0.305: LED73.K LED81.K LED89.K LED97.K LED105.K LED113.K LED121.K | LED73.K LED65.K LED57.K LED49.K LED41.K LED33.K LED25.K LED17.K LED9.K LED1.K | T8.1 64.14,26.67 63.18,27.62 63.18,71.16 LED73.K

### Text on the board
Top: LED-Matrix | shackspace.de | by Saij